# Altium schematic sheet 5V_SUPPLY.SchDoc
size A4; SheetNumber: 4; SheetTotal: 16
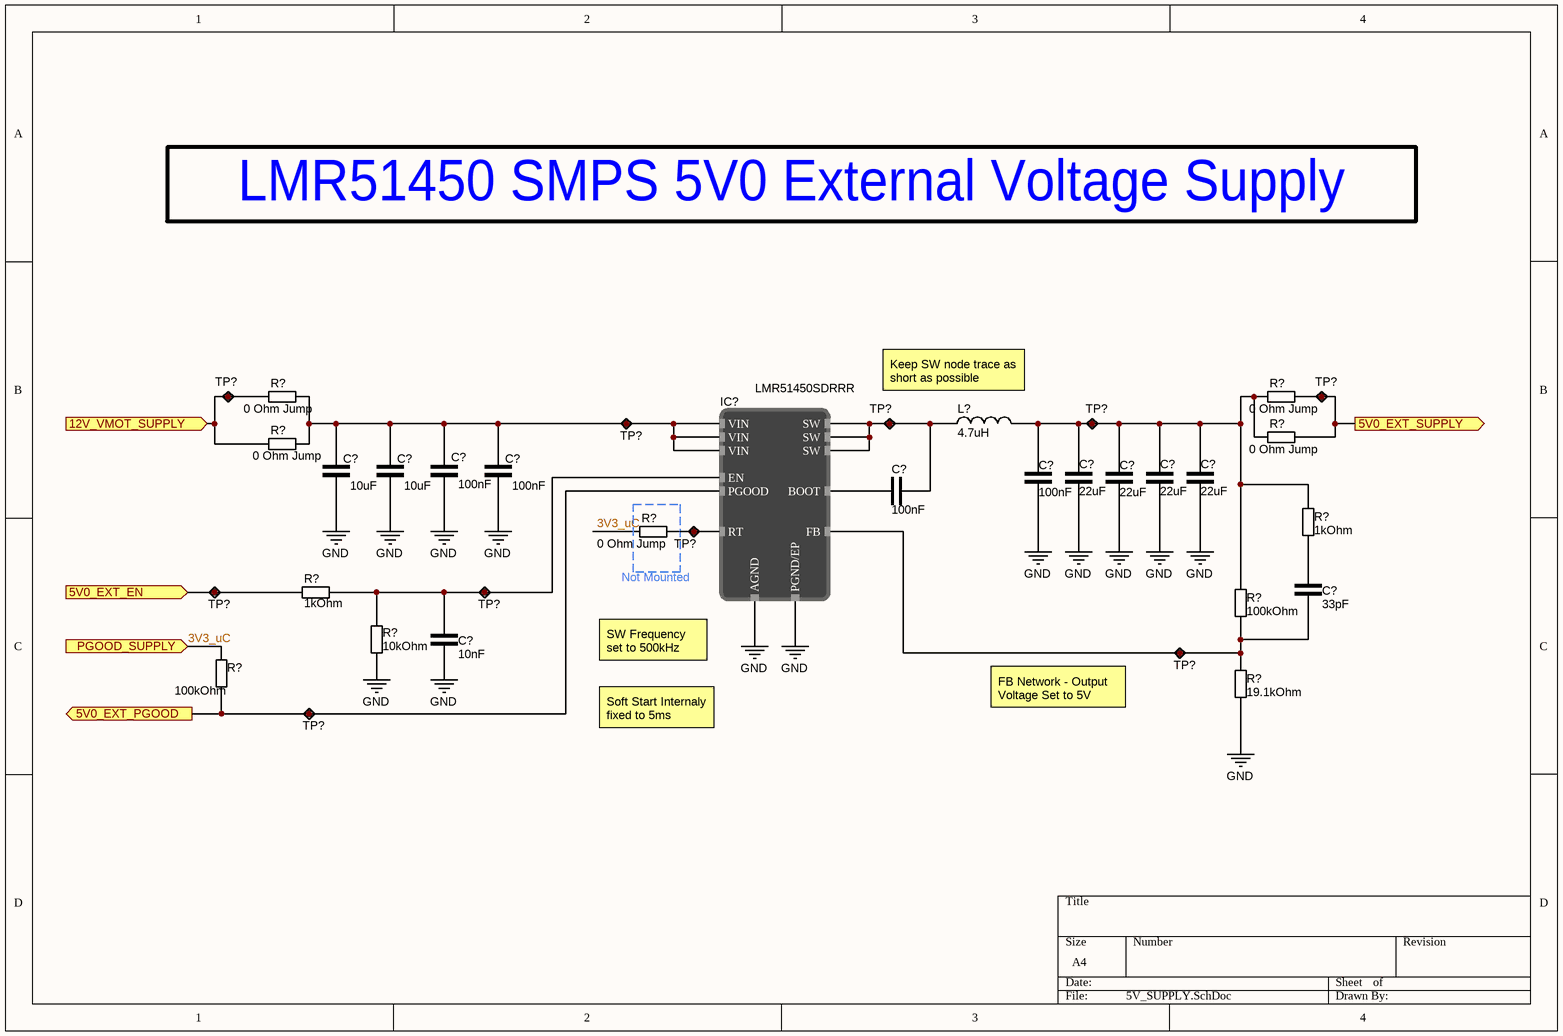
[diagram p0: 5V_SUPPLY.SchDoc]

## Parts
(Parts that share a designator on the sheet are numbered #1, #2 ... from top to bottom, then left to right.)
C?#1  10uF  [CAP_0805]
C?#2  10uF  [CAP_0805]
C?#3  100nF  [CAP_0603]
C?#4  100nF  [CAP_0603]
C?#5  100nF  [CAP_0603]
C?#6  22uF  [CAP_0805]
C?#7  22uF  [CAP_0805]
C?#8  22uF  [CAP_0805]
C?#9  22uF  [CAP_0805]
C?#10  100nF  [CAP_0603]
C?#11  33pF  [CAP_0603]
C?#12  10nF  [CAP_0603]
IC?  LMR51450SDRRR  [SON50P300X80_HS-13N]
L?  4.7uH  [INDP6965X30N]
R?#1  0 Ohm Jump  [RES_0805]
R?#2  0 Ohm Jump  [RES_1206]
R?#3  0 Ohm Jump  [RES_1206]
R?#4  0 Ohm Jump  [RES_0805]
R?#5  1kOhm  [RES_0603]
R?#6  0 Ohm Jump  [RES_0603]
R?#7  1kOhm  [RES_0603]
R?#8  100kOhm  [RES_0603]
R?#9  10kOhm  [RES_0603]
R?#10  100kOhm  [RES_0603]
R?#11  19.1kOhm  [RES_0603]
TP?#1  Test point  [TestPoint]  (value not drawn)
TP?#2  Test point  [TestPoint]  (value not drawn)
TP?#3  Test point  [TestPoint]  (value not drawn)
TP?#4  Test point  [TestPoint]  (value not drawn)
TP?#5  Test point  [TestPoint]  (value not drawn)
TP?#6  Test point  [TestPoint]  (value not drawn)
TP?#7  Test point  [TestPoint]  (value not drawn)
TP?#8  Test point  [TestPoint]  (value not drawn)
TP?#9  Test point  [TestPoint]  (value not drawn)
TP?#10  Test point  [TestPoint]  (value not drawn)

## Ports
5V0_EXT_EN (in), 5V0_EXT_PGOOD (out), 5V0_EXT_SUPPLY (out), 12V_VMOT_SUPPLY (in), PGOOD_SUPPLY (in)

## Nets
GND: C?#1.1 C?#2.1 C?#3.2 C?#4.1 C?#5.1 C?#6.1 C?#7.2 C?#8.1 C?#9.1 C?#12.1 IC?.8(AGND) IC?.13(PGND/EP) R?#9.1 R?#11.1
3V3_uC: R?#6.1 R?#10.2 ; port PGOOD_SUPPLY
5V0_EXT_EN: R?#7.1 TP?#7.1 ; port 5V0_EXT_EN
5V0_EXT_PGOOD: IC?.5(PGOOD) R?#10.1 TP?#10.1 ; port 5V0_EXT_PGOOD
5V0_EXT_SUPPLY: R?#2.2 R?#3.2 TP?#2.1 ; port 5V0_EXT_SUPPLY
12V_VMOT_SUPPLY: R?#1.1 R?#4.1 TP?#1.1 ; port 12V_VMOT_SUPPLY
NetC?#1_2: C?#1.2 C?#2.2 C?#3.1 C?#4.2 IC?.10(VIN) IC?.11(VIN) IC?.12(VIN) R?#1.2 R?#4.2 TP?#3.1
NetC?#5_2: C?#5.2 C?#6.2 C?#7.1 C?#8.2 C?#9.2 L?.2 R?#2.1 R?#3.1 R?#5.2 R?#8.2 TP?#5.1
NetC?#10_1: C?#10.1 IC?.4(BOOT)
NetC?#10_2: C?#10.2 IC?.1(SW) IC?.2(SW) IC?.3(SW) L?.1 TP?#4.1
NetC?#11_1: C?#11.1 IC?.7(FB) R?#8.1 R?#11.2 TP?#9.1
NetC?#11_2: C?#11.2 R?#5.1
NetC?#12_2: C?#12.2 IC?.9(EN) R?#7.2 R?#9.2 TP?#8.1
NetIC?_6: IC?.6(RT) R?#6.2 TP?#6.1

## Notes on the sheet
- LMR51450 SMPS 5V0 External Voltage Supply
- Keep SW node trace as short as possible
- Not Mounted
- (near IC?) SW Frequency set to 500kHz
- FB Network - Output Voltage Set to 5V
- Soft Start Internaly fixed to 5ms

## Library data of the parts
C?#1 C?#2 = C000002: 10 µF ±10% 25V Ceramic Capacitor X5R 0805 (2012 Metric); ComponentLink1Description: DigiKey; ComponentLink1URL: https://www.digikey.com/en/products/detail/tdk-corporation/C2012X5R1E106K125AB/2443462; DigiKey Part Number: 445-5984-1-ND; capacitance: 10uF
C?#3-C?#5 C?#10 = C000007: 0.1 µF ±10% 25V Ceramic Capacitor X7R 0603 (1608 Metric); ComponentLink1Description: DigiKey; ComponentLink1URL: https://www.digikey.com/en/products/detail/kyocera-avx/06033C104K4T2A/8019250; DigiKey Part Number: 478-KAM15AR71E104KTCT-ND; capacitance: 100nF
C?#6-C?#9 = C000001: 22 µF ±20% 25V Ceramic Capacitor X5R 0805 (2012 Metric); ComponentLink1Description: DigiKey; ComponentLink1URL: https://www.digikey.com/en/products/detail/tdk-corporation/C2012X5R1E226M125AC/3661564; DigiKey Part Number: 445-9112-1-ND; capacitance: 22uF
C?#11 = C000029: 33 pF ±5% 25V Ceramic Capacitor C0G, NP0 0603 (1608 Metric); ComponentLink1Description: DigiKey; ComponentLink1URL: https://www.digikey.com/en/products/detail/yageo/CC0603JRNPO8BN330/5883595; DigiKey Part Number: 311-3954-1-ND; capacitance: 33pF
C?#12 = C000005: 10000 pF ±20% 25V Ceramic Capacitor X7R 0603 (1608 Metric); ComponentLink1Description: DigiKey; ComponentLink1URL: https://www.digikey.com/en/products/detail/kyocera-avx/06033C103MAT2A/1599370; DigiKey Part Number: 478-KGM15AR71E103MTCT-ND; capacitance: 10nF
IC? = LMR51450SDRRR: Buck Switching Regulator IC Positive Adjustable 0.8V 1 Output 5A 12-WFDFN Exposed Pad; DigiKey Part Number: 296-LMR51450SDRRRCT-ND; ComponentLink1Description: DigiKey; ComponentLink1URL: https://www.digikey.com/en/products/detail/texas-instruments/LMR51450SDRRR/17394946; Mouser Part Number: 595-LMR51450SDRRR; ComponentLink2Description: Mouser; ComponentLink2URL: https://eu.mouser.com/ProductDetail/Texas-Instruments/LMR51450SDRRR?qs=rQFj71Wb1eUvKinsjoLiUA%3D%3D
L? = L000011: FIXED IND 4.7UH 5.5A 40 MOHM SMD; inductance: 4.7uH; DigiKey Part Number: 541-1010-1-ND; ComponentLink1Description: DigiKey; ComponentLink1URL: https://www.digikey.com/en/products/detail/vishay-dale/IHLP2525CZER4R7M01/1220675
R?#1 R?#4 = R000011: 0 Ohms Jumper Chip Resistor 0805 (2012 Metric) Automotive AEC-Q200 Thick Film; ComponentLink1Description: DigiKey; ComponentLink1URL: https://www.digikey.com/en/products/detail/panasonic-electronic-components/ERJ-6GEY0R00V/78163; resistance: 0 Ohm Jump; DigiKey Part Number: P0.0ACT-ND
R?#2 R?#3 = R000012: 0 Ohms Jumper Chip Resistor 1206 (3216 Metric) Automotive AEC-Q200 Thick Film; ComponentLink1Description: DigiKey; ComponentLink1URL: https://www.digikey.com/en/products/detail/stackpole-electronics-inc/RMCF1206ZT0R00/1756906; resistance: 0 Ohm Jump; DigiKey Part Number: RMCF1206ZT0R00CT-ND
R?#5 R?#7 = R000004: 1 kOhms ±1% 0.125W, 1/8W Chip Resistor 0603 (1608 Metric) Anti-Sulfur Thin Film; resistance: 1kOhm; ComponentLink1Description: DigiKey; ComponentLink1URL: https://www.digikey.com/en/products/detail/vishay-beyschlag-draloric-bc-components/MCT06030C1001FP500/2607821; DigiKey Part Number: MCT0603-1.00K-CFCT-ND
R?#6 = R000007: 0 Ohms Jumper Chip Resistor 0603 (1608 Metric) Automotive AEC-Q200 Thick Film; ComponentLink1Description: DigiKey; ComponentLink1URL: https://www.digikey.com/en/products/detail/stackpole-electronics-inc/RMCF0603ZT0R00/1756908; resistance: 0 Ohm Jump; DigiKey Part Number: RMCF0603ZT0R00CT-ND
R?#8 R?#10 = R000006: 100 kOhms ±1% 0.1W, 1/10W Chip Resistor 0603 (1608 Metric) Automotive AEC-Q200 Thick Film; resistance: 100kOhm; ComponentLink1Description: DigiKey; ComponentLink1URL: https://www.digikey.com/en/products/detail/stackpole-electronics-inc/RMCF0603FG100K/1713543; DigiKey Part Number: RMCF0603FG100KCT-ND
R?#9 = R000001: 10 kOhms ±1% 0.125W, 1/8W Chip Resistor 0603 (1608 Metric) Anti-Sulfur Thin Film; resistance: 10kOhm; ComponentLink1Description: DigiKey; ComponentLink1URL: https://www.digikey.com/en/products/detail/vishay-beyschlag-draloric-bc-components/MCT06030C1002FP500/1850440; DigiKey Part Number: MCT0603-10.0K-CFCT-ND
R?#11 = R000020: 19.1 kOhms ±1% 0.1W, 1/10W Chip Resistor 0603 (1608 Metric) Moisture Resistant Thick Film; ComponentLink1Description: DigiKey; ComponentLink1URL: https://www.digikey.com/en/products/detail/yageo/RC0603FR-0719K1L/727001; resistance: 19.1kOhm; DigiKey Part Number: 311-19.1KHRCT-ND
TP?#1-TP?#10 = TP002: Test point 1mm